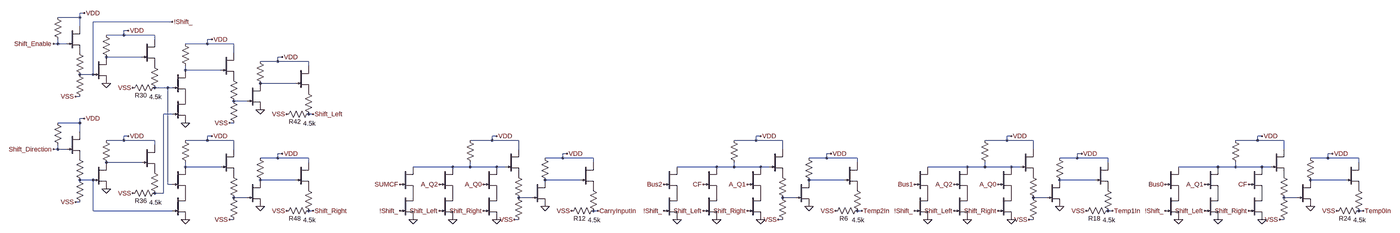
[diagram p0: schematic shifter_3bit.asc, whole sheet]
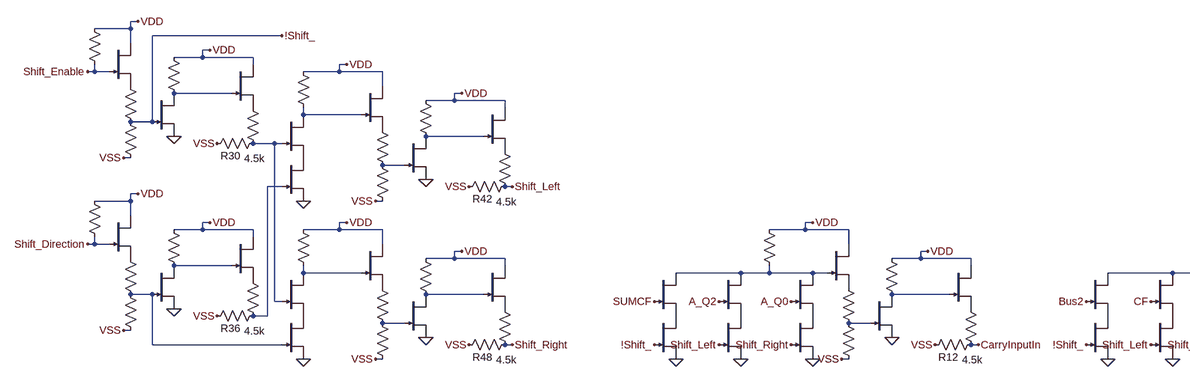
[diagram p1: schematic shifter_3bit.asc, part, row 1 of 1, column 1 of 2]
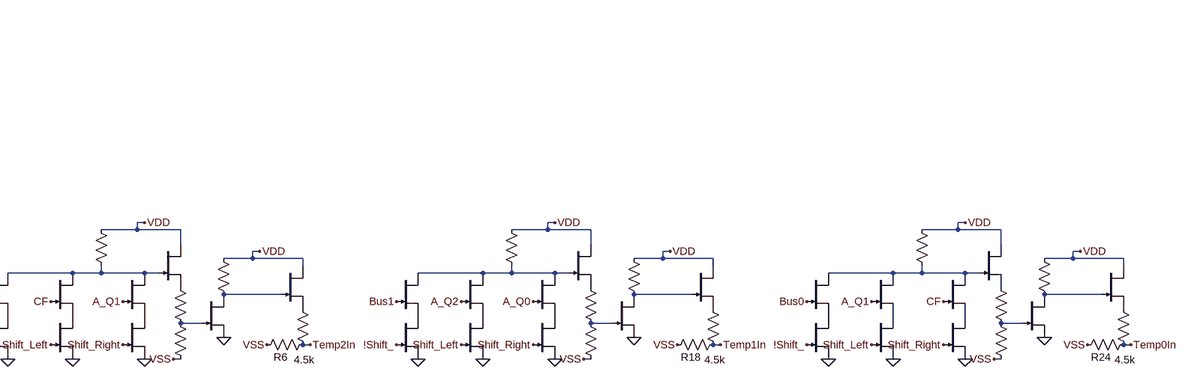
[diagram p2: schematic shifter_3bit.asc, part, row 1 of 1, column 2 of 2]
shifter_3bit.asc, the LTspice schematic file:
Version 4.1
SHEET 1 109444 42780
WIRE -4192 4224 -4208 4224
WIRE -3232 4224 -3248 4224
WIRE -4208 4240 -4208 4224
WIRE -4208 4240 -4288 4240
WIRE -4112 4240 -4208 4240
WIRE -3248 4240 -3248 4224
WIRE -3248 4240 -3328 4240
WIRE -3152 4240 -3248 4240
WIRE -4112 4272 -4112 4240
WIRE -3152 4272 -3152 4240
WIRE -3936 4288 -3952 4288
WIRE -2976 4288 -2992 4288
WIRE -3952 4304 -3952 4288
WIRE -3952 4304 -4016 4304
WIRE -3840 4304 -3952 4304
WIRE -2992 4304 -2992 4288
WIRE -2992 4304 -3056 4304
WIRE -2880 4304 -2992 4304
WIRE -3840 4320 -3840 4304
WIRE -2880 4320 -2880 4304
WIRE -4352 4336 -4496 4336
WIRE -4288 4336 -4288 4320
WIRE -4288 4336 -4352 4336
WIRE -4192 4336 -4288 4336
WIRE -4160 4336 -4192 4336
WIRE -3392 4336 -3536 4336
WIRE -3328 4336 -3328 4320
WIRE -3328 4336 -3392 4336
WIRE -3232 4336 -3328 4336
WIRE -3200 4336 -3232 4336
WIRE -3888 4384 -4016 4384
WIRE -2928 4384 -3056 4384
WIRE -4064 4448 -4112 4448
WIRE -3104 4448 -3152 4448
WIRE -3824 4496 -3840 4496
WIRE -2864 4496 -2880 4496
WIRE -4112 4528 -4128 4528
WIRE -3152 4528 -3168 4528
FLAG -3232 4528 0
FLAG -3392 4528 0
FLAG -3056 4480 0
FLAG -3232 4224 VDD
FLAG -2976 4288 VDD
FLAG -3168 4528 VSS
FLAG -2960 4496 VSS
FLAG -3440 4496 Shift_Left
FLAG -3280 4496 Shift_Right
FLAG -3536 4528 0
FLAG -3584 4496 !Shift_
FLAG -3584 4400 Bus2
FLAG -3440 4400 CF
FLAG -4192 4528 0
FLAG -4352 4528 0
FLAG -4016 4480 0
FLAG -4192 4224 VDD
FLAG -3936 4288 VDD
FLAG -4128 4528 VSS
FLAG -3920 4496 VSS
FLAG -4400 4496 Shift_Left
FLAG -4240 4496 Shift_Right
FLAG -4496 4528 0
FLAG -4544 4496 !Shift_
FLAG -4240 4400 A_Q0
FLAG -2864 4496 Temp2In
FLAG -3824 4496 CarryInputIn
FLAG -4544 4400 SUMCF
FLAG -3280 4400 A_Q1
FLAG -4400 4400 A_Q2
SYMBOL njf -3440 4336 R0
WINDOW 3 198 224 Invisible 2
WINDOW 0 56 32 Invisible 2
SYMATTR Value DR
SYMATTR InstName J_A1
SYMBOL res -3344 4224 R0
WINDOW 0 -35 57 Invisible 2
WINDOW 3 34 56 Invisible 2
SYMATTR InstName R1
SYMATTR Value 100k
SYMBOL njf -3200 4272 R0
WINDOW 0 56 32 Invisible 2
WINDOW 3 56 72 Invisible 2
SYMATTR InstName J_F1
SYMATTR Value DR
SYMBOL res -3168 4352 R0
WINDOW 0 -136 215 Invisible 2
WINDOW 3 34 58 Invisible 2
SYMATTR InstName R2
SYMATTR Value 1k
SYMBOL res -3168 4432 R0
WINDOW 0 -10 158 Invisible 2
WINDOW 3 37 62 Invisible 2
SYMATTR InstName R3
SYMATTR Value 4.8k
SYMBOL njf -3280 4336 R0
WINDOW 0 56 32 Invisible 2
WINDOW 3 56 72 Invisible 2
SYMATTR InstName J_B1
SYMATTR Value DR
SYMBOL njf -3104 4384 R0
WINDOW 0 56 32 Invisible 2
WINDOW 3 56 72 Invisible 2
SYMATTR InstName J_A2
SYMATTR Value DR
SYMBOL res -3072 4288 R0
WINDOW 0 56 32 Invisible 2
WINDOW 3 56 72 Invisible 2
SYMATTR InstName R4
SYMATTR Value 50k
SYMBOL njf -2928 4320 R0
WINDOW 0 56 32 Invisible 2
WINDOW 3 56 72 Invisible 2
SYMATTR InstName J_A3
SYMATTR Value DR
SYMBOL res -2896 4400 R0
WINDOW 0 37 24 Invisible 2
WINDOW 3 -30 25 Invisible 2
SYMATTR InstName R5
SYMATTR Value 1k
SYMBOL res -2864 4480 R90
WINDOW 0 59 66 VBottom 2
WINDOW 3 34 13 VTop 2
SYMATTR InstName R6
SYMATTR Value 4.5k
SYMBOL njf -3440 4432 R0
WINDOW 0 119 134 Invisible 2
WINDOW 3 131 136 Invisible 2
SYMATTR InstName J_A4
SYMATTR Value DR
SYMBOL njf -3280 4432 R0
WINDOW 3 -27 143 Invisible 2
WINDOW 0 56 32 Invisible 2
SYMATTR Value DR
SYMATTR InstName J_B2
SYMBOL njf -3584 4336 R0
WINDOW 0 63 15 Invisible 2
WINDOW 3 62 106 Invisible 2
SYMATTR InstName J_A5
SYMATTR Value DR
SYMBOL njf -3584 4432 R0
WINDOW 0 254 138 Invisible 2
WINDOW 3 277 142 Invisible 2
SYMATTR InstName J_A6
SYMATTR Value DR
SYMBOL njf -4400 4336 R0
WINDOW 3 198 224 Invisible 2
WINDOW 0 56 32 Invisible 2
SYMATTR Value DR
SYMATTR InstName J_A7
SYMBOL res -4304 4224 R0
WINDOW 0 -35 57 Invisible 2
WINDOW 3 34 56 Invisible 2
SYMATTR InstName R7
SYMATTR Value 100k
SYMBOL njf -4160 4272 R0
WINDOW 0 56 32 Invisible 2
WINDOW 3 56 72 Invisible 2
SYMATTR InstName J_F2
SYMATTR Value DR
SYMBOL res -4128 4352 R0
WINDOW 0 -136 215 Invisible 2
WINDOW 3 34 58 Invisible 2
SYMATTR InstName R8
SYMATTR Value 1k
SYMBOL res -4128 4432 R0
WINDOW 0 -10 158 Invisible 2
WINDOW 3 37 62 Invisible 2
SYMATTR InstName R9
SYMATTR Value 4.8k
SYMBOL njf -4240 4336 R0
WINDOW 0 56 32 Invisible 2
WINDOW 3 56 72 Invisible 2
SYMATTR InstName J_B3
SYMATTR Value DR
SYMBOL njf -4064 4384 R0
WINDOW 0 56 32 Invisible 2
WINDOW 3 56 72 Invisible 2
SYMATTR InstName J_A8
SYMATTR Value DR
SYMBOL res -4032 4288 R0
WINDOW 0 56 32 Invisible 2
WINDOW 3 56 72 Invisible 2
SYMATTR InstName R10
SYMATTR Value 50k
SYMBOL njf -3888 4320 R0
WINDOW 0 56 32 Invisible 2
WINDOW 3 56 72 Invisible 2
SYMATTR InstName J_A9
SYMATTR Value DR
SYMBOL res -3856 4400 R0
WINDOW 0 37 24 Invisible 2
WINDOW 3 -30 25 Invisible 2
SYMATTR InstName R11
SYMATTR Value 1k
SYMBOL res -3824 4480 R90
WINDOW 0 59 66 VBottom 2
WINDOW 3 34 13 VTop 2
SYMATTR InstName R12
SYMATTR Value 4.5k
SYMBOL njf -4400 4432 R0
WINDOW 0 119 134 Invisible 2
WINDOW 3 131 136 Invisible 2
SYMATTR InstName J_A10
SYMATTR Value DR
SYMBOL njf -4240 4432 R0
WINDOW 3 -27 143 Invisible 2
WINDOW 0 56 32 Invisible 2
SYMATTR Value DR
SYMATTR InstName J_B4
SYMBOL njf -4544 4336 R0
WINDOW 0 63 15 Invisible 2
WINDOW 3 62 106 Invisible 2
SYMATTR InstName J_A11
SYMATTR Value DR
SYMBOL njf -4544 4432 R0
WINDOW 0 254 138 Invisible 2
WINDOW 3 277 142 Invisible 2
SYMATTR InstName J_A12
SYMATTR Value DR
WIRE -2320 4224 -2336 4224
WIRE -2336 4240 -2336 4224
WIRE -2336 4240 -2416 4240
WIRE -2240 4240 -2336 4240
WIRE -2240 4272 -2240 4240
WIRE -2064 4288 -2080 4288
WIRE -2080 4304 -2080 4288
WIRE -2080 4304 -2144 4304
WIRE -1968 4304 -2080 4304
WIRE -1968 4320 -1968 4304
WIRE -2480 4336 -2624 4336
WIRE -2416 4336 -2416 4320
WIRE -2416 4336 -2480 4336
WIRE -2320 4336 -2416 4336
WIRE -2288 4336 -2320 4336
WIRE -2016 4384 -2144 4384
WIRE -2192 4448 -2240 4448
WIRE -1952 4496 -1968 4496
WIRE -2240 4528 -2256 4528
FLAG -2320 4528 0
FLAG -2480 4528 0
FLAG -2144 4480 0
FLAG -2320 4224 VDD
FLAG -2064 4288 VDD
FLAG -2256 4528 VSS
FLAG -2048 4496 VSS
FLAG -2528 4496 Shift_Left
FLAG -2368 4496 Shift_Right
FLAG -2624 4528 0
FLAG -2672 4496 !Shift_
FLAG -2672 4400 Bus1
FLAG -2528 4400 A_Q2
FLAG -1952 4496 Temp1In
FLAG -2368 4400 A_Q0
SYMBOL njf -2528 4336 R0
WINDOW 3 198 224 Invisible 2
WINDOW 0 56 32 Invisible 2
SYMATTR Value DR
SYMATTR InstName J_A13
SYMBOL res -2432 4224 R0
WINDOW 0 -35 57 Invisible 2
WINDOW 3 34 56 Invisible 2
SYMATTR InstName R13
SYMATTR Value 100k
SYMBOL njf -2288 4272 R0
WINDOW 0 56 32 Invisible 2
WINDOW 3 56 72 Invisible 2
SYMATTR InstName J_F3
SYMATTR Value DR
SYMBOL res -2256 4352 R0
WINDOW 0 -136 215 Invisible 2
WINDOW 3 34 58 Invisible 2
SYMATTR InstName R14
SYMATTR Value 1k
SYMBOL res -2256 4432 R0
WINDOW 0 -10 158 Invisible 2
WINDOW 3 37 62 Invisible 2
SYMATTR InstName R15
SYMATTR Value 4.8k
SYMBOL njf -2368 4336 R0
WINDOW 0 56 32 Invisible 2
WINDOW 3 56 72 Invisible 2
SYMATTR InstName J_B5
SYMATTR Value DR
SYMBOL njf -2192 4384 R0
WINDOW 0 56 32 Invisible 2
WINDOW 3 56 72 Invisible 2
SYMATTR InstName J_A14
SYMATTR Value DR
SYMBOL res -2160 4288 R0
WINDOW 0 56 32 Invisible 2
WINDOW 3 56 72 Invisible 2
SYMATTR InstName R16
SYMATTR Value 50k
SYMBOL njf -2016 4320 R0
WINDOW 0 56 32 Invisible 2
WINDOW 3 56 72 Invisible 2
SYMATTR InstName J_A15
SYMATTR Value DR
SYMBOL res -1984 4400 R0
WINDOW 0 37 24 Invisible 2
WINDOW 3 -30 25 Invisible 2
SYMATTR InstName R17
SYMATTR Value 1k
SYMBOL res -1952 4480 R90
WINDOW 0 59 66 VBottom 2
WINDOW 3 34 13 VTop 2
SYMATTR InstName R18
SYMATTR Value 4.5k
SYMBOL njf -2528 4432 R0
WINDOW 0 119 134 Invisible 2
WINDOW 3 131 136 Invisible 2
SYMATTR InstName J_A16
SYMATTR Value DR
SYMBOL njf -2368 4432 R0
WINDOW 3 -27 143 Invisible 2
WINDOW 0 56 32 Invisible 2
SYMATTR Value DR
SYMATTR InstName J_B6
SYMBOL njf -2672 4336 R0
WINDOW 0 63 15 Invisible 2
WINDOW 3 62 106 Invisible 2
SYMATTR InstName J_A17
SYMATTR Value DR
SYMBOL njf -2672 4432 R0
WINDOW 0 254 138 Invisible 2
WINDOW 3 277 142 Invisible 2
SYMATTR InstName J_A18
SYMATTR Value DR
WIRE -1408 4224 -1424 4224
WIRE -1424 4240 -1424 4224
WIRE -1424 4240 -1504 4240
WIRE -1328 4240 -1424 4240
WIRE -1328 4272 -1328 4240
WIRE -1152 4288 -1168 4288
WIRE -1168 4304 -1168 4288
WIRE -1168 4304 -1232 4304
WIRE -1056 4304 -1168 4304
WIRE -1056 4320 -1056 4304
WIRE -1568 4336 -1712 4336
WIRE -1504 4336 -1504 4320
WIRE -1504 4336 -1568 4336
WIRE -1408 4336 -1504 4336
WIRE -1376 4336 -1408 4336
WIRE -1104 4384 -1232 4384
WIRE -1280 4448 -1328 4448
WIRE -1040 4496 -1056 4496
WIRE -1328 4528 -1344 4528
FLAG -1408 4528 0
FLAG -1568 4528 0
FLAG -1232 4480 0
FLAG -1408 4224 VDD
FLAG -1152 4288 VDD
FLAG -1344 4528 VSS
FLAG -1136 4496 VSS
FLAG -1616 4496 Shift_Left
FLAG -1456 4496 Shift_Right
FLAG -1712 4528 0
FLAG -1760 4496 !Shift_
FLAG -1760 4400 Bus0
FLAG -1616 4400 A_Q1
FLAG -1040 4496 Temp0In
FLAG -1456 4400 CF
SYMBOL njf -1616 4336 R0
WINDOW 3 198 224 Invisible 2
WINDOW 0 56 32 Invisible 2
SYMATTR Value DR
SYMATTR InstName J_A19
SYMBOL res -1520 4224 R0
WINDOW 0 -35 57 Invisible 2
WINDOW 3 34 56 Invisible 2
SYMATTR InstName R19
SYMATTR Value 100k
SYMBOL njf -1376 4272 R0
WINDOW 0 56 32 Invisible 2
WINDOW 3 56 72 Invisible 2
SYMATTR InstName J_F4
SYMATTR Value DR
SYMBOL res -1344 4352 R0
WINDOW 0 -136 215 Invisible 2
WINDOW 3 34 58 Invisible 2
SYMATTR InstName R20
SYMATTR Value 1k
SYMBOL res -1344 4432 R0
WINDOW 0 -10 158 Invisible 2
WINDOW 3 37 62 Invisible 2
SYMATTR InstName R21
SYMATTR Value 4.8k
SYMBOL njf -1456 4336 R0
WINDOW 0 56 32 Invisible 2
WINDOW 3 56 72 Invisible 2
SYMATTR InstName J_B7
SYMATTR Value DR
SYMBOL njf -1280 4384 R0
WINDOW 0 56 32 Invisible 2
WINDOW 3 56 72 Invisible 2
SYMATTR InstName J_A20
SYMATTR Value DR
SYMBOL res -1248 4288 R0
WINDOW 0 56 32 Invisible 2
WINDOW 3 56 72 Invisible 2
SYMATTR InstName R22
SYMATTR Value 50k
SYMBOL njf -1104 4320 R0
WINDOW 0 56 32 Invisible 2
WINDOW 3 56 72 Invisible 2
SYMATTR InstName J_A21
SYMATTR Value DR
SYMBOL res -1072 4400 R0
WINDOW 0 37 24 Invisible 2
WINDOW 3 -30 25 Invisible 2
SYMATTR InstName R23
SYMATTR Value 1k
SYMBOL res -1040 4480 R90
WINDOW 0 59 66 VBottom 2
WINDOW 3 34 13 VTop 2
SYMATTR InstName R24
SYMATTR Value 4.5k
SYMBOL njf -1616 4432 R0
WINDOW 0 119 134 Invisible 2
WINDOW 3 131 136 Invisible 2
SYMATTR InstName J_A22
SYMATTR Value DR
SYMBOL njf -1456 4432 R0
WINDOW 3 -27 143 Invisible 2
WINDOW 0 56 32 Invisible 2
SYMATTR Value DR
SYMATTR InstName J_B8
SYMBOL njf -1760 4336 R0
WINDOW 0 63 15 Invisible 2
WINDOW 3 62 106 Invisible 2
SYMATTR InstName J_A23
SYMATTR Value DR
SYMBOL njf -1760 4432 R0
WINDOW 0 254 138 Invisible 2
WINDOW 3 277 142 Invisible 2
SYMATTR InstName J_A24
SYMATTR Value DR
WIRE -5792 3776 -5808 3776
WIRE -5808 3792 -5808 3776
WIRE -5808 3792 -5888 3792
WIRE -5472 3808 -5760 3808
WIRE -5808 3824 -5808 3792
WIRE -5632 3840 -5648 3840
WIRE -5648 3856 -5648 3840
WIRE -5648 3856 -5712 3856
WIRE -5536 3856 -5648 3856
WIRE -5536 3872 -5536 3856
WIRE -5328 3872 -5344 3872
WIRE -5888 3888 -5888 3872
WIRE -5888 3888 -5904 3888
WIRE -5856 3888 -5888 3888
WIRE -5344 3888 -5344 3872
WIRE -5344 3888 -5424 3888
WIRE -5248 3888 -5344 3888
WIRE -5248 3920 -5248 3888
WIRE -5584 3936 -5712 3936
WIRE -5072 3936 -5088 3936
WIRE -5088 3952 -5088 3936
WIRE -5088 3952 -5152 3952
WIRE -4976 3952 -5088 3952
WIRE -4976 3968 -4976 3952
WIRE -5424 3984 -5424 3968
WIRE -5296 3984 -5424 3984
WIRE -5760 4000 -5760 3808
WIRE -5760 4000 -5808 4000
WIRE -5024 4032 -5152 4032
WIRE -5488 4048 -5536 4048
WIRE -5472 4048 -5488 4048
WIRE -5808 4080 -5824 4080
WIRE -5200 4096 -5248 4096
WIRE -5472 4144 -5504 4144
WIRE -4960 4144 -4976 4144
WIRE -5792 4160 -5808 4160
WIRE -5808 4176 -5808 4160
WIRE -5808 4176 -5888 4176
WIRE -5248 4176 -5264 4176
WIRE -5808 4208 -5808 4176
WIRE -5632 4224 -5648 4224
WIRE -5328 4224 -5344 4224
WIRE -5648 4240 -5648 4224
WIRE -5648 4240 -5712 4240
WIRE -5536 4240 -5648 4240
WIRE -5344 4240 -5344 4224
WIRE -5344 4240 -5424 4240
WIRE -5248 4240 -5344 4240
WIRE -5536 4256 -5536 4240
WIRE -5888 4272 -5888 4256
WIRE -5888 4272 -5904 4272
WIRE -5856 4272 -5888 4272
WIRE -5248 4272 -5248 4240
WIRE -5072 4288 -5088 4288
WIRE -5088 4304 -5088 4288
WIRE -5088 4304 -5152 4304
WIRE -4976 4304 -5088 4304
WIRE -5584 4320 -5712 4320
WIRE -4976 4320 -4976 4304
WIRE -5424 4336 -5424 4320
WIRE -5296 4336 -5424 4336
WIRE -5760 4384 -5808 4384
WIRE -5024 4384 -5152 4384
WIRE -5488 4400 -5488 4048
WIRE -5472 4400 -5488 4400
WIRE -5504 4432 -5504 4144
WIRE -5504 4432 -5536 4432
WIRE -5200 4448 -5248 4448
WIRE -5808 4464 -5824 4464
WIRE -5760 4496 -5760 4384
WIRE -5472 4496 -5760 4496
WIRE -4960 4496 -4976 4496
WIRE -5248 4528 -5264 4528
FLAG -5712 4032 0
FLAG -5792 3776 VDD
FLAG -5632 3840 VDD
FLAG -5824 4080 VSS
FLAG -5616 4048 VSS
FLAG -5904 3888 Shift_Enable
FLAG -5712 4416 0
FLAG -5792 4160 VDD
FLAG -5632 4224 VDD
FLAG -5824 4464 VSS
FLAG -5616 4432 VSS
FLAG -5904 4272 Shift_Direction
FLAG -4960 4496 Shift_Right
FLAG -4960 4144 Shift_Left
FLAG -5472 3808 !Shift_
FLAG -5424 4176 0
FLAG -5152 4128 0
FLAG -5328 3872 VDD
FLAG -5072 3936 VDD
FLAG -5264 4176 VSS
FLAG -5056 4144 VSS
FLAG -5424 4528 0
FLAG -5152 4480 0
FLAG -5328 4224 VDD
FLAG -5072 4288 VDD
FLAG -5264 4528 VSS
FLAG -5056 4496 VSS
SYMBOL res -5904 3776 R0
WINDOW 0 -35 57 Invisible 2
WINDOW 3 34 56 Invisible 2
SYMATTR InstName R25
SYMATTR Value 100k
SYMBOL njf -5856 3824 R0
WINDOW 0 56 32 Invisible 2
WINDOW 3 56 72 Invisible 2
SYMATTR InstName J_F5
SYMATTR Value DR
SYMBOL res -5824 3904 R0
WINDOW 0 -24 60 Invisible 2
WINDOW 3 34 58 Invisible 2
SYMATTR InstName R26
SYMATTR Value 1k
SYMBOL res -5824 3984 R0
WINDOW 0 -22 62 Invisible 2
WINDOW 3 37 62 Invisible 2
SYMATTR InstName R27
SYMATTR Value 4.8k
SYMBOL njf -5760 3936 R0
WINDOW 0 56 32 Invisible 2
WINDOW 3 56 72 Invisible 2
SYMATTR InstName J_A25
SYMATTR Value DR
SYMBOL res -5728 3840 R0
WINDOW 0 56 32 Invisible 2
WINDOW 3 56 72 Invisible 2
SYMATTR InstName R28
SYMATTR Value 50k
SYMBOL njf -5584 3872 R0
WINDOW 0 56 32 Invisible 2
WINDOW 3 56 72 Invisible 2
SYMATTR InstName J_A26
SYMATTR Value DR
SYMBOL res -5552 3952 R0
WINDOW 0 37 24 Invisible 2
WINDOW 3 -30 25 Invisible 2
SYMATTR InstName R29
SYMATTR Value 1k
SYMBOL res -5520 4032 R90
WINDOW 0 59 66 VBottom 2
WINDOW 3 34 13 VTop 2
SYMATTR InstName R30
SYMATTR Value 4.5k
SYMBOL res -5904 4160 R0
WINDOW 0 -35 57 Invisible 2
WINDOW 3 34 56 Invisible 2
SYMATTR InstName R31
SYMATTR Value 100k
SYMBOL njf -5856 4208 R0
WINDOW 0 56 32 Invisible 2
WINDOW 3 56 72 Invisible 2
SYMATTR InstName J_F6
SYMATTR Value DR
SYMBOL res -5824 4288 R0
WINDOW 0 -24 60 Invisible 2
WINDOW 3 34 58 Invisible 2
SYMATTR InstName R32
SYMATTR Value 1k
SYMBOL res -5824 4368 R0
WINDOW 0 -22 62 Invisible 2
WINDOW 3 37 62 Invisible 2
SYMATTR InstName R33
SYMATTR Value 4.8k
SYMBOL njf -5760 4320 R0
WINDOW 0 56 32 Invisible 2
WINDOW 3 56 72 Invisible 2
SYMATTR InstName J_A27
SYMATTR Value DR
SYMBOL res -5728 4224 R0
WINDOW 0 56 32 Invisible 2
WINDOW 3 56 72 Invisible 2
SYMATTR InstName R34
SYMATTR Value 50k
SYMBOL njf -5584 4256 R0
WINDOW 0 56 32 Invisible 2
WINDOW 3 56 72 Invisible 2
SYMATTR InstName J_A28
SYMATTR Value DR
SYMBOL res -5552 4336 R0
WINDOW 0 37 24 Invisible 2
WINDOW 3 -30 25 Invisible 2
SYMATTR InstName R35
SYMATTR Value 1k
SYMBOL res -5520 4416 R90
WINDOW 0 59 66 VBottom 2
WINDOW 3 34 13 VTop 2
SYMATTR InstName R36
SYMATTR Value 4.5k
SYMBOL res -5440 3872 R0
WINDOW 0 79 204 Invisible 2
WINDOW 3 83 172 Invisible 2
SYMATTR InstName R37
SYMATTR Value 100k
SYMBOL njf -5296 3920 R0
WINDOW 0 56 32 Invisible 2
WINDOW 3 56 72 Invisible 2
SYMATTR InstName J_F7
SYMATTR Value DR
SYMBOL res -5264 4000 R0
WINDOW 0 -136 215 Invisible 2
WINDOW 3 34 58 Invisible 2
SYMATTR InstName R38
SYMATTR Value 1k
SYMBOL res -5264 4080 R0
WINDOW 0 -68 47 Invisible 2
WINDOW 3 37 62 Invisible 2
SYMATTR InstName R39
SYMATTR Value 4.8k
SYMBOL njf -5472 3984 R0
WINDOW 0 56 32 Invisible 2
WINDOW 3 56 72 Invisible 2
SYMATTR InstName J_B9
SYMATTR Value DR
SYMBOL njf -5200 4032 R0
WINDOW 0 56 32 Invisible 2
WINDOW 3 56 72 Invisible 2
SYMATTR InstName J_A29
SYMATTR Value DR
SYMBOL res -5168 3936 R0
WINDOW 0 56 32 Invisible 2
WINDOW 3 56 72 Invisible 2
SYMATTR InstName R40
SYMATTR Value 50k
SYMBOL njf -5024 3968 R0
WINDOW 0 56 32 Invisible 2
WINDOW 3 56 72 Invisible 2
SYMATTR InstName J_A30
SYMATTR Value DR
SYMBOL res -4992 4048 R0
WINDOW 0 37 24 Invisible 2
WINDOW 3 -30 25 Invisible 2
SYMATTR InstName R41
SYMATTR Value 1k
SYMBOL res -4960 4128 R90
WINDOW 0 59 66 VBottom 2
WINDOW 3 34 13 VTop 2
SYMATTR InstName R42
SYMATTR Value 4.5k
SYMBOL njf -5472 4080 R0
WINDOW 3 110 95 Invisible 2
WINDOW 0 56 32 Invisible 2
SYMATTR Value DR
SYMATTR InstName J_B10
SYMBOL res -5440 4224 R0
WINDOW 0 79 204 Invisible 2
WINDOW 3 83 172 Invisible 2
SYMATTR InstName R43
SYMATTR Value 100k
SYMBOL njf -5296 4272 R0
WINDOW 0 56 32 Invisible 2
WINDOW 3 56 72 Invisible 2
SYMATTR InstName J_F8
SYMATTR Value DR
SYMBOL res -5264 4352 R0
WINDOW 0 -136 215 Invisible 2
WINDOW 3 34 58 Invisible 2
SYMATTR InstName R44
SYMATTR Value 1k
SYMBOL res -5264 4432 R0
WINDOW 0 -68 47 Invisible 2
WINDOW 3 37 62 Invisible 2
SYMATTR InstName R45
SYMATTR Value 4.8k
SYMBOL njf -5472 4336 R0
WINDOW 0 56 32 Invisible 2
WINDOW 3 56 72 Invisible 2
SYMATTR InstName J_B11
SYMATTR Value DR
SYMBOL njf -5200 4384 R0
WINDOW 0 56 32 Invisible 2
WINDOW 3 56 72 Invisible 2
SYMATTR InstName J_A31
SYMATTR Value DR
SYMBOL res -5168 4288 R0
WINDOW 0 56 32 Invisible 2
WINDOW 3 56 72 Invisible 2
SYMATTR InstName R46
SYMATTR Value 50k
SYMBOL njf -5024 4320 R0
WINDOW 0 56 32 Invisible 2
WINDOW 3 56 72 Invisible 2
SYMATTR InstName J_A32
SYMATTR Value DR
SYMBOL res -4992 4400 R0
WINDOW 0 37 24 Invisible 2
WINDOW 3 -30 25 Invisible 2
SYMATTR InstName R47
SYMATTR Value 1k
SYMBOL res -4960 4480 R90
WINDOW 0 59 66 VBottom 2
WINDOW 3 34 13 VTop 2
SYMATTR InstName R48
SYMATTR Value 4.5k
SYMBOL njf -5472 4432 R0
WINDOW 3 110 95 Invisible 2
WINDOW 0 56 32 Invisible 2
SYMATTR Value DR
SYMATTR InstName J_B12

The netlist it stands for:
* shifter_3bit.asc
J_A1 N002 CF P001 DR
R1 VDD N002 100k
J_F1 VDD N002 P002 DR
R2 P002 N006 1k
R3 N006 VSS 4.8k
J_B1 N002 A_Q1 P003 DR
J_A2 N004 N006 0 DR
R4 VDD N004 50k
J_A3 VDD N004 P004 DR
R5 P004 Temp2In 1k
R6 Temp2In VSS 4.5k
J_A4 P001 Shift_Left 0 DR
J_B2 P003 Shift_Right 0 DR
J_A5 N002 Bus2 P005 DR
J_A6 P005 !Shift_ 0 DR
J_A7 N001 A_Q2 P006 DR
R7 VDD N001 100k
J_F2 VDD N001 P007 DR
R8 P007 N005 1k
R9 N005 VSS 4.8k
J_B3 N001 A_Q0 P008 DR
J_A8 N003 N005 0 DR
R10 VDD N003 50k
J_A9 VDD N003 P009 DR
R11 P009 CarryInputIn 1k
R12 CarryInputIn VSS 4.5k
J_A10 P006 Shift_Left 0 DR
J_B4 P008 Shift_Right 0 DR
J_A11 N001 SUMCF P010 DR
J_A12 P010 !Shift_ 0 DR
J_A13 N007 A_Q2 P011 DR
R13 VDD N007 100k
J_F3 VDD N007 P012 DR
R14 P012 N009 1k
R15 N009 VSS 4.8k
J_B5 N007 A_Q0 P013 DR
J_A14 N008 N009 0 DR
R16 VDD N008 50k
J_A15 VDD N008 P014 DR
R17 P014 Temp1In 1k
R18 Temp1In VSS 4.5k
J_A16 P011 Shift_Left 0 DR
J_B6 P013 Shift_Right 0 DR
J_A17 N007 Bus1 P015 DR
J_A18 P015 !Shift_ 0 DR
J_A19 N010 A_Q1 P016 DR
R19 VDD N010 100k
J_F4 VDD N010 P017 DR
R20 P017 N012 1k
R21 N012 VSS 4.8k
J_B7 N010 CF P018 DR
J_A20 N011 N012 0 DR
R22 VDD N011 50k
J_A21 VDD N011 P019 DR
R23 P019 Temp0In 1k
R24 Temp0In VSS 4.5k
J_A22 P016 Shift_Left 0 DR
J_B8 P018 Shift_Right 0 DR
J_A23 N010 Bus0 P020 DR
J_A24 P020 !Shift_ 0 DR
R25 VDD Shift_Enable 100k
J_F5 VDD Shift_Enable P021 DR
R26 P021 !Shift_ 1k
R27 !Shift_ VSS 4.8k
J_A25 N013 !Shift_ 0 DR
R28 VDD N013 50k
J_A26 VDD N013 P022 DR
R29 P022 N016 1k
R30 N016 VSS 4.5k
R31 VDD Shift_Direction 100k
J_F6 VDD Shift_Direction P023 DR
R32 P023 N021 1k
R33 N021 VSS 4.8k
J_A27 N019 N021 0 DR
R34 VDD N019 50k
J_A28 VDD N019 P024 DR
R35 P024 N018 1k
R36 N018 VSS 4.5k
R37 VDD N014 100k
J_F7 VDD N014 P025 DR
R38 P025 N017 1k
R39 N017 VSS 4.8k
J_B9 N014 N016 P026 DR
J_A29 N015 N017 0 DR
R40 VDD N015 50k
J_A30 VDD N015 P027 DR
R41 P027 Shift_Left 1k
R42 Shift_Left VSS 4.5k
J_B10 P026 N018 0 DR
R43 VDD N020 100k
J_F8 VDD N020 P028 DR
R44 P028 N023 1k
R45 N023 VSS 4.8k
J_B11 N020 N016 P029 DR
J_A31 N022 N023 0 DR
R46 VDD N022 50k
J_A32 VDD N022 P030 DR
R47 P030 Shift_Right 1k
R48 Shift_Right VSS 4.5k
J_B12 P029 N021 0 DR
.model NJF NJF
.model PJF PJF
.lib standard.jft
.backanno
.end